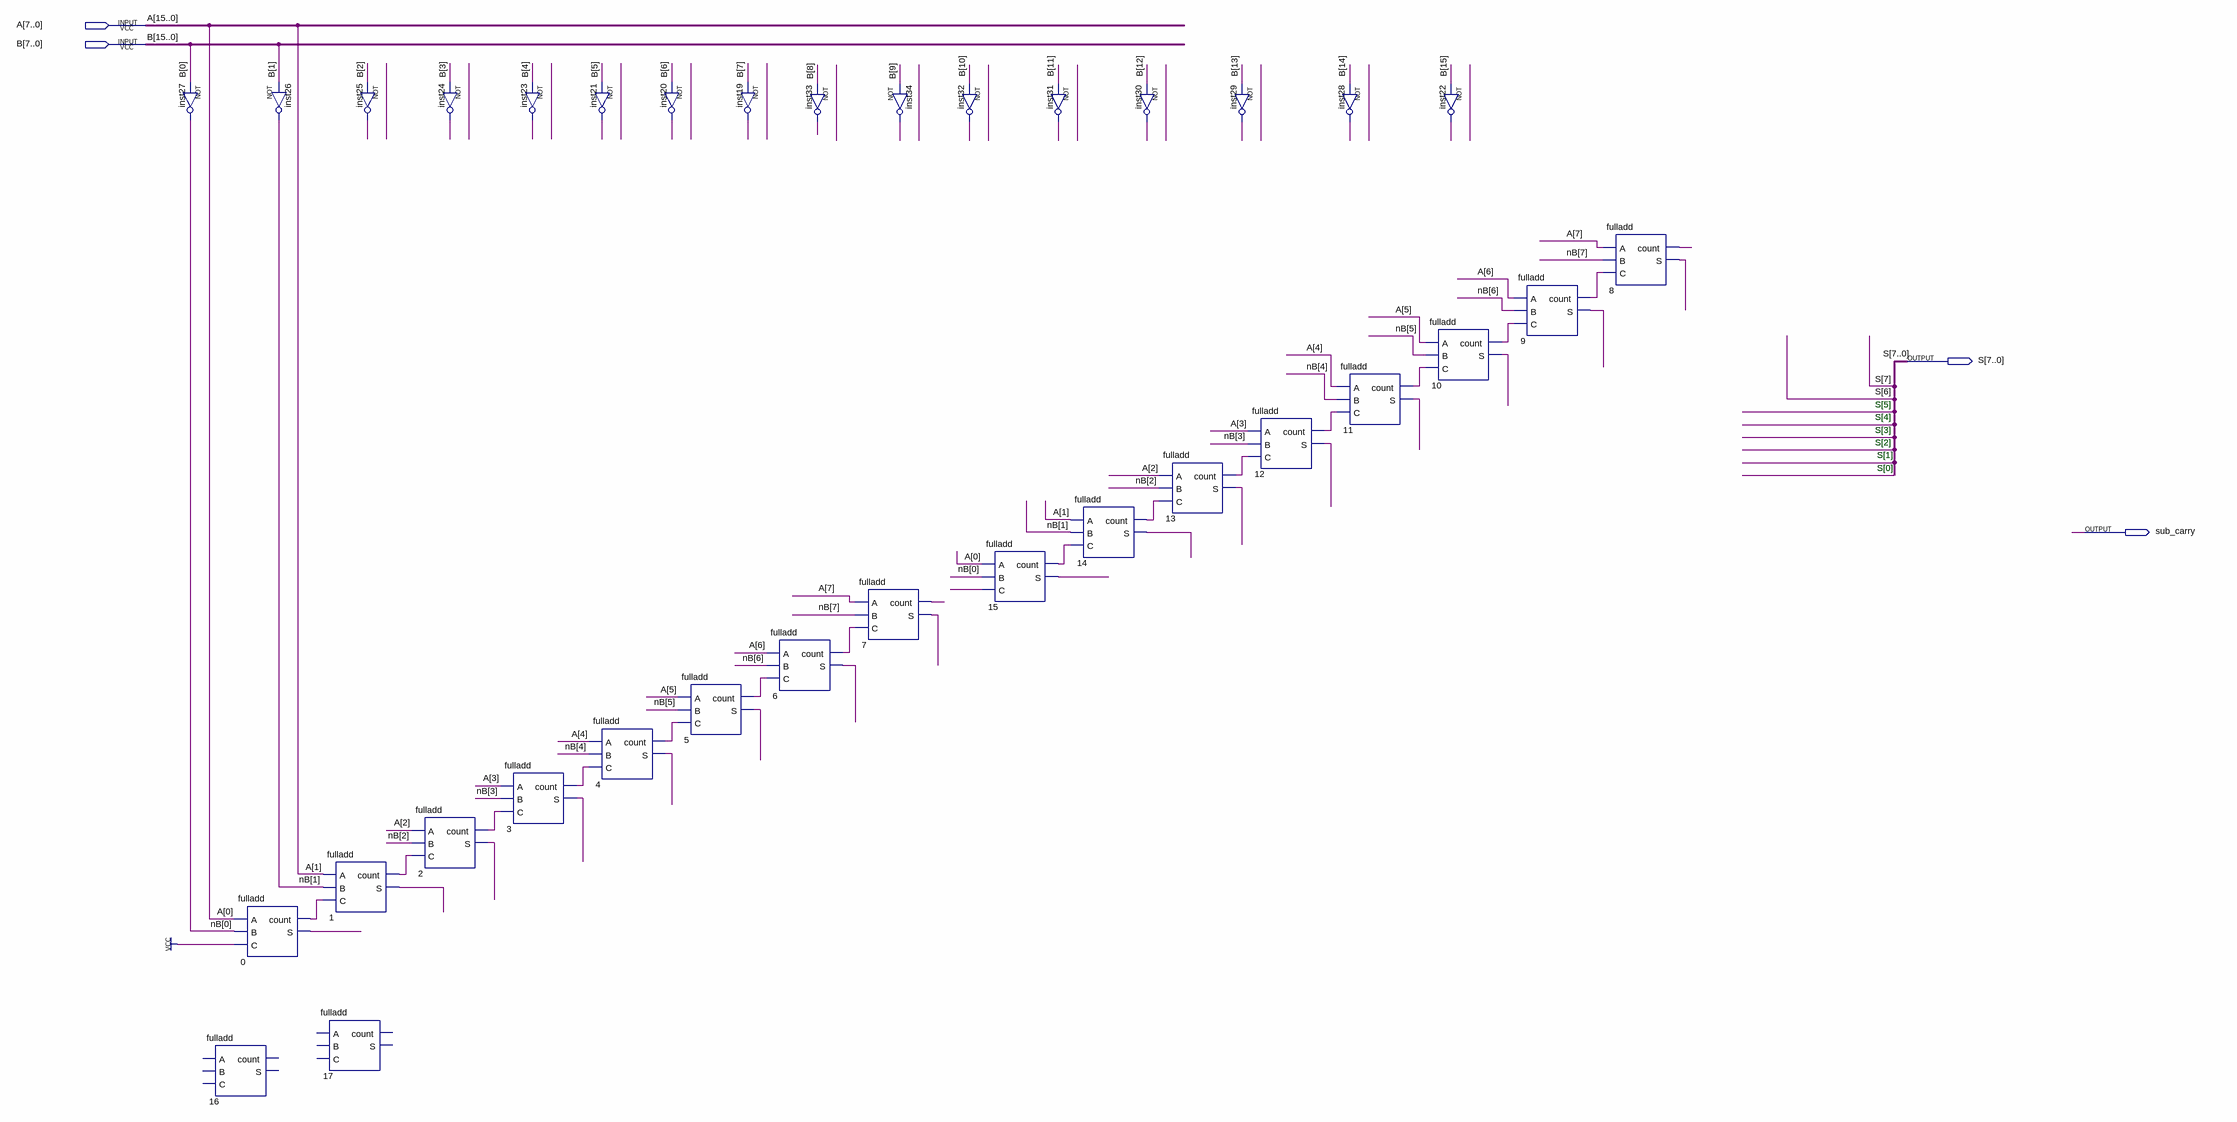
[diagram p0: schematic sheet]
// Quartus schematic CMP_unit.bdf as structural Verilog: 34 symbols, 4 pins
module CMP_unit (
  input  [7:0] A,
  input  [15:0] B,
  output [7:0] S,
  output sub_carry
);

  wire inst19_out, inst20_out, inst21_out, inst22_out, inst23_out, inst24_out, inst25_out, inst28_out,
       inst29_out, inst30_out, inst31_out, inst32_out, inst33_out, inst34_out, n0_count, n0_s, n1_count,
       n1_s, n2_count, n2_s, n3_count, n3_s, n4_count, n4_s, n5_count, n5_s, n6_count, n6_s, n7_count, n7_s,
       n8_count, n8_s, n9_count, n9_s, n10_count, n10_s, n11_count, n11_s, n12_count, n12_s, n13_count,
       n13_s, n14_count, n14_s, n15_count, n15_s, undriven;
  wire [7:0] nB;

  not inst27 (nB[0], B[0]);
  fulladd u_0 (.A(A[0]), .B(nB[0]), .C(1'b1), .count(n0_count), .S(n0_s));
  fulladd u_16 ();  // open: A, B, C, count, S
  not inst26 (nB[1], B[1]);
  fulladd u_1 (.A(A[1]), .B(nB[1]), .C(n0_count), .count(n1_count), .S(n1_s));
  fulladd u_17 ();  // open: A, B, C, count, S
  not inst25 (inst25_out, B[2]);
  not inst24 (inst24_out, B[3]);
  fulladd u_2 (.A(A[2]), .B(nB[2]), .C(n1_count), .count(n2_count), .S(n2_s));
  fulladd u_3 (.A(A[3]), .B(nB[3]), .C(n2_count), .count(n3_count), .S(n3_s));
  not inst23 (inst23_out, B[4]);
  not inst21 (inst21_out, B[5]);
  fulladd u_4 (.A(A[4]), .B(nB[4]), .C(n3_count), .count(n4_count), .S(n4_s));
  not inst20 (inst20_out, B[6]);
  fulladd u_5 (.A(A[5]), .B(nB[5]), .C(n4_count), .count(n5_count), .S(n5_s));
  not inst19 (inst19_out, B[7]);
  not inst33 (inst33_out, B[8]);
  fulladd u_6 (.A(A[6]), .B(nB[6]), .C(n5_count), .count(n6_count), .S(n6_s));
  fulladd u_7 (.A(A[7]), .B(nB[7]), .C(n6_count), .count(n7_count), .S(n7_s));
  not inst34 (inst34_out, B[9]);
  not inst32 (inst32_out, B[10]);
  fulladd u_15 (.A(A[0]), .B(nB[0]), .C(undriven), .count(n15_count), .S(n15_s));
  not inst31 (inst31_out, B[11]);
  fulladd u_14 (.A(A[1]), .B(nB[1]), .C(n15_count), .count(n14_count), .S(n14_s));
  not inst30 (inst30_out, B[12]);
  fulladd u_13 (.A(A[2]), .B(nB[2]), .C(n14_count), .count(n13_count), .S(n13_s));
  not inst29 (inst29_out, B[13]);
  fulladd u_12 (.A(A[3]), .B(nB[3]), .C(n13_count), .count(n12_count), .S(n12_s));
  not inst28 (inst28_out, B[14]);
  fulladd u_11 (.A(A[4]), .B(nB[4]), .C(n12_count), .count(n11_count), .S(n11_s));
  not inst22 (inst22_out, B[15]);
  fulladd u_10 (.A(A[5]), .B(nB[5]), .C(n11_count), .count(n10_count), .S(n10_s));
  fulladd u_9 (.A(A[6]), .B(nB[6]), .C(n10_count), .count(n9_count), .S(n9_s));
  fulladd u_8 (.A(A[7]), .B(nB[7]), .C(n9_count), .count(n8_count), .S(n8_s));

  // Notes on the sheet:
  //   S[5]
  //   S[4]
  //   S[3]
  //   S[2]
  //   S[1]
  //   S[0]
endmodule
